# Altium schematic sheet Bluetooth&Gyroscope.SchDoc
size 420 x 297 mm; SheetNumber: 2; SheetTotal: 6; Разработчик: Волков; Проверяющий: Андрейчук; Технический_контроль: Ашуркевич; Нормативный_контроль: Василевская; Утвердил: Чвала; Номер_листа: 1; Количество_листов: 4; Организация: МРК; Номер_документа: ТЗСЦ.421457.001Э3; Название_документа: Устройство управления сервоприводами на основе микроконтроллера STM32
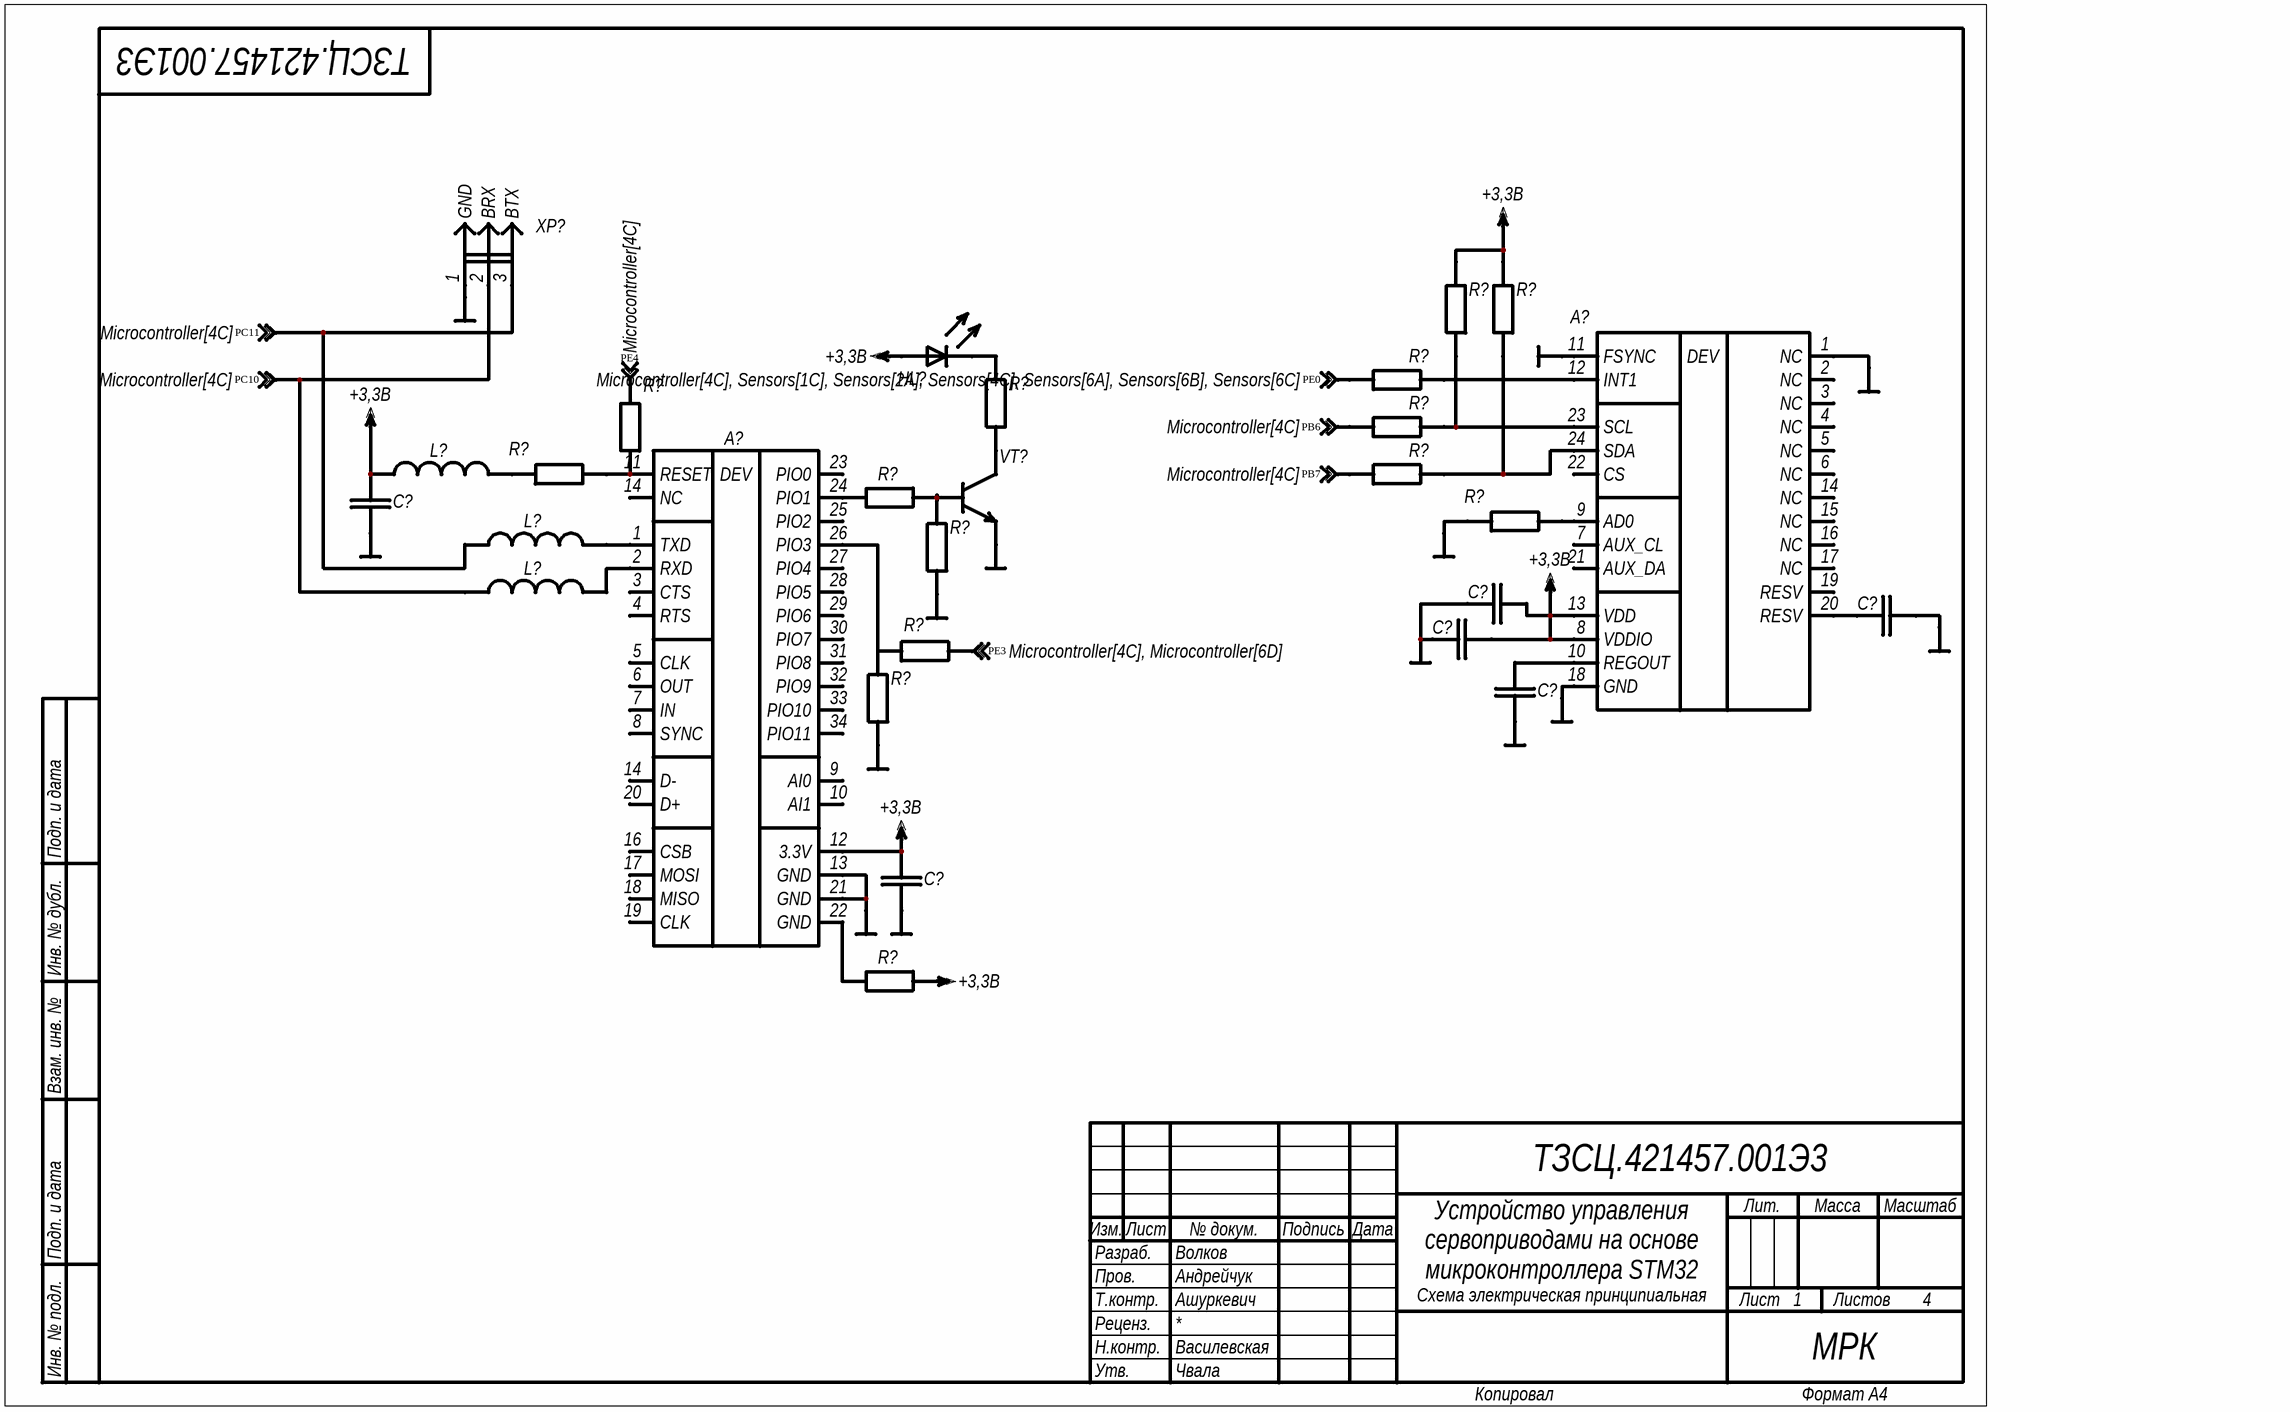
[diagram p0: Bluetooth&Gyroscope.SchDoc]

## Parts
(Parts that share a designator on the sheet are numbered #1, #2 ... from top to bottom, then left to right.)
A?#1  ICM-20948  (value not drawn)
A?#2  HC-06  (value not drawn)
C?#1  Capacitor_Fixed  (value not drawn)
C?#2  Capacitor_Fixed  (value not drawn)
C?#3  Capacitor_Fixed  (value not drawn)
C?#4  Capacitor_Fixed  (value not drawn)
C?#5  Capacitor_Fixed  (value not drawn)
C?#6  Capacitor_Fixed  (value not drawn)
HL?  Diode_Light_Emitting  (value not drawn)
L?#1  Inductor  (value not drawn)
L?#2  Inductor  (value not drawn)
L?#3  Inductor  (value not drawn)
R?#1  Resistor_Fixed  (value not drawn)
R?#2  Resistor_Fixed  (value not drawn)
R?#3  Resistor_Fixed  (value not drawn)
R?#4  Resistor_Fixed  (value not drawn)
R?#5  Resistor_Fixed  (value not drawn)
R?#6  Resistor_Fixed  (value not drawn)
R?#7  Resistor_Fixed  (value not drawn)
R?#8  Resistor_Fixed  (value not drawn)
R?#9  Resistor_Fixed  (value not drawn)
R?#10  Resistor_Fixed  (value not drawn)
R?#11  Resistor_Fixed  (value not drawn)
R?#12  Resistor_Fixed  (value not drawn)
R?#13  Resistor_Fixed  (value not drawn)
R?#14  Resistor_Fixed  (value not drawn)
VT?  BC817  (value not drawn)
XP?  Connector_Bluetooth  (value not drawn)

## Nets
+3,3В: A?#1.8(VDDIO) A?#1.13(VDD) A?#2.12(3.3V) C?#1.2 C?#2.2 C?#4.2 C?#6.1 HL?.1(Anode) L?#1.1 R?#1.2 R?#2.2 R?#14.1
GND: A?#1.1(NC) A?#1.11(FSYNC) A?#1.18(GND) A?#2.13(GND) A?#2.21(GND) C?#1.1 C?#2.1 C?#3.2 C?#4.1 C?#5.1 C?#6.2 R?#10.1 R?#11.1 R?#13.1 VT?.2(Emitter) XP?.1(GND)
PB6: R?#4.1 ; off-sheet PB6
PB7: R?#8.1 ; off-sheet PB7
PC10: L?#3.1 XP?.2(BRX) ; off-sheet PC10
PC11: L?#2.1 XP?.3(BTX) ; off-sheet PC11
PE0: R?#3.1 ; off-sheet PE0
PE3: R?#12.2 ; off-sheet PE3
PE4: R?#7.2 ; off-sheet PE4
NetA?#1_9: A?#1.9(AD0) R?#10.2
NetA?#1_10: A?#1.10(REGOUT) C?#5.2
NetA?#1_12: A?#1.12(INT1) R?#3.2
NetA?#1_20: A?#1.20(RESV) C?#3.1
NetA?#1_23: A?#1.23(SCL) R?#1.1 R?#4.2
NetA?#1_24: A?#1.24(SDA) R?#2.1 R?#8.2
NetA?#2_1: A?#2.1(TXD) L?#2.2
NetA?#2_2: A?#2.2(RXD) L?#3.2
NetA?#2_11: A?#2.11(RESET) R?#6.2 R?#7.1
NetA?#2_22: A?#2.22(GND) R?#14.2
NetA?#2_24: A?#2.24(PIO1) R?#9.2
NetA?#2_26: A?#2.26(PIO3) R?#12.1 R?#13.2
NetHL?_2: HL?.2(Cathode) R?#5.2
NetL?#1_2: L?#1.2 R?#6.1
NetR?#5_1: R?#5.1 VT?.3(Collector)
NetR?#9_1: R?#9.1 R?#11.2 VT?.1(Base)

Not connected (* = marked no-connect by the designer): A?#1 2(NC) 3(NC) 4(NC) 5(NC) 6(NC) 7(AUX_CL) 14(NC) 15(NC) 16(NC) 17(NC) 19(RESV) 21(AUX_DA) 22(CS); A?#2 3(CTS) 4(RTS) 5(CLK) 6(OUT) 7(IN) 8(SYNC) 9(AI0) 10(AI1) 14(NC) 16(CSB) 17(MOSI) 18(MISO) 19(CLK) 20(D+) 23(PIO0) 25(PIO2) 27(PIO4) 28(PIO5) 29(PIO6) 30(PIO7) 31(PIO8) 32(PIO9) 33(PIO10) 34(PIO11)

## Notes on the sheet
- Подп. и дата
- Инв. № дубл.
- Взам. инв. №
- Разраб.
- Изм.
- Лист
- № докум.
- Подпись
- Дата
- Лит.
- Масса
- Масштаб
- Пров.
- Т.контр.
- Схема электрическая принципиальная
- Листов
- Реценз.
- Н.контр.
- Утв.
- Инв. № подл.
- Копировал
- Формат А4
- (in symbol Device_Bluetooth_HC-06) DEV
- (in symbol Device_Gyroscope_Accelerometer_ICM-20948) DEV

## Library data of the parts
A?#1 = Device_Gyroscope_Accelerometer_ICM-20948: 24 pin 3,3V; ComponentLink1Description: chipdip; ComponentLink1URL: https://www.chipdip.ru/product0/8025239061; ComponentLink2Description: datasheet; ComponentLink2URL: https://static.chipdip.ru/lib/718/DOC011718862.pdf
A?#2 = Device_Bluetooth_HC-06: 34 pin 3,3V; ComponentLink1Description: chipdip; ComponentLink1URL: https://www.chipdip.ru/product/hc-06; ComponentLink2Description: datasheet; ComponentLink2URL: https://static.chipdip.ru/lib/734/DOC021734960.pdf; ComponentLink3Description: elecbee; ComponentLink3URL: https://www.elecbee.com/en-24700-RS232-TTL-HC-06-Wireless-bluetooth-RF-Transceiver-Serial-Module
C?#1-C?#6 = Capacitor_Fixed: 2 pin
HL? = Diode_Light_Emitting: 2 pin
L?#1-L?#3 = Inductor: 2 pin
R?#1-R?#14 = Resistor_Fixed: 2 pin
VT? = Transistor_Bipolar_NPN_BC817: 3 pin; ComponentLink1Description: chipdip; ComponentLink1URL: https://www.chipdip.by/product/bc817-40; ComponentLink2Description: datasheet; ComponentLink2URL: https://static.chipdip.ru/lib/156/DOC000156781.pdf
XP? = Connector_Bluetooth: 3 pin